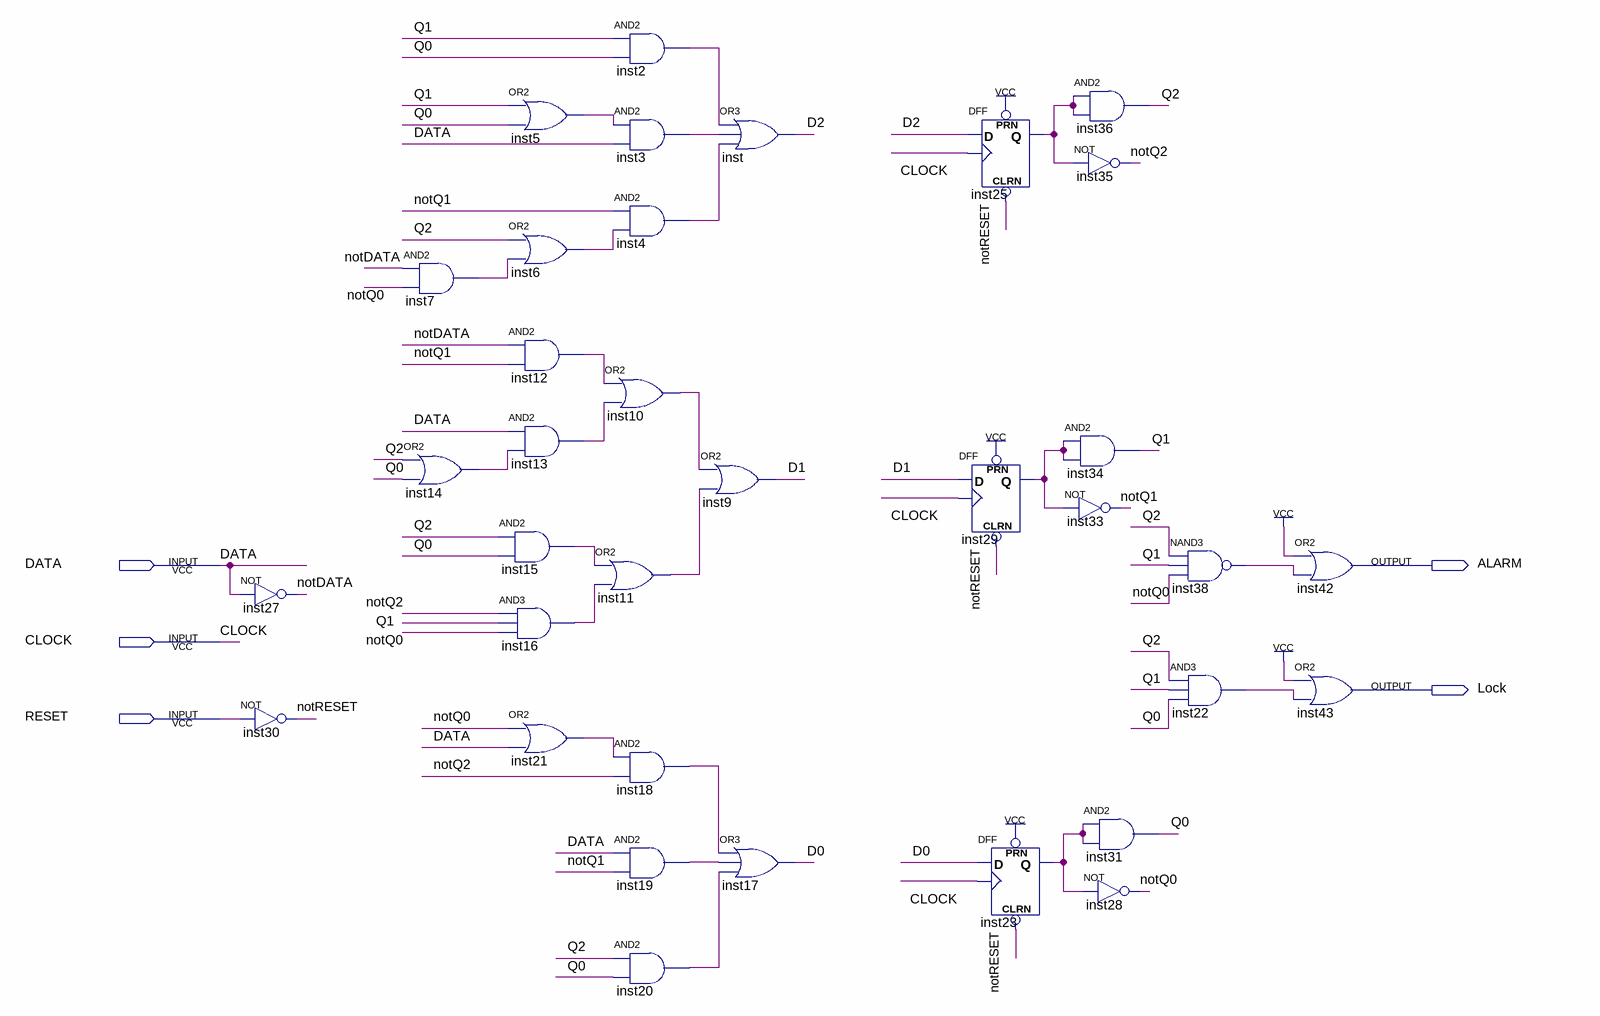
[diagram p0: schematic sheet]
// Quartus schematic db_lock.bdf as structural Verilog: 35 symbols, 5 pins
module db_lock (
  input  DATA,
  input  CLOCK,
  input  RESET,
  output ALARM,
  output Lock
);

  wire D0, D1, D2, inst2_out, inst3_out, inst4_out, inst5_out, inst6_out, inst7_out, inst10_out, inst11_out,
       inst12_out, inst13_out, inst14_out, inst15_out, inst16_out, inst18_out, inst19_out, inst20_out,
       inst21_out, inst22_out, inst23_q, inst25_q, inst29_q, inst38_out, notDATA, notQ0, notQ1, notQ2,
       notRESET, Q0, Q1, Q2;

  not inst27 (notDATA, DATA);
  not inst30 (notRESET, RESET);
  and inst7 (inst7_out, notDATA, notQ0);
  or inst14 (inst14_out, Q2, Q0);
  or inst5 (inst5_out, Q1, Q0);
  or inst6 (inst6_out, Q2, inst7_out);
  and inst12 (inst12_out, notDATA, notQ1);
  and inst13 (inst13_out, DATA, inst14_out);
  and inst15 (inst15_out, Q2, Q0);
  and inst16 (inst16_out, notQ2, Q1, notQ0);
  or inst21 (inst21_out, notQ0, DATA);
  and inst2 (inst2_out, Q1, Q0);
  and inst3 (inst3_out, inst5_out, DATA);
  and inst4 (inst4_out, notQ1, inst6_out);
  or inst10 (inst10_out, inst12_out, inst13_out);
  or inst11 (inst11_out, inst15_out, inst16_out);
  and inst18 (inst18_out, inst21_out, notQ2);
  and inst19 (inst19_out, DATA, notQ1);
  and inst20 (inst20_out, Q2, Q0);
  or inst (D2, inst2_out, inst3_out, inst4_out);
  or inst9 (D1, inst10_out, inst11_out);
  or inst17 (D0, inst18_out, inst19_out, inst20_out);
  DFF inst25 (.CLRN(notRESET), .CLK(CLOCK), .D(D2), .PRN(1'b1), .Q(inst25_q));
  DFF inst29 (.CLRN(notRESET), .CLK(CLOCK), .D(D1), .PRN(1'b1), .Q(inst29_q));
  DFF inst23 (.CLRN(notRESET), .CLK(CLOCK), .D(D0), .PRN(1'b1), .Q(inst23_q));
  and inst36 (Q2, inst25_q, inst25_q);
  not inst35 (notQ2, inst25_q);
  and inst34 (Q1, inst29_q, inst29_q);
  not inst33 (notQ1, inst29_q);
  and inst31 (Q0, inst23_q, inst23_q);
  not inst28 (notQ0, inst23_q);
  nand inst38 (inst38_out, Q2, Q1, notQ0);
  and inst22 (inst22_out, Q2, Q1, Q0);
  or inst42 (ALARM, 1'b1, inst38_out);
  or inst43 (Lock, 1'b1, inst22_out);
endmodule
